# EasyEDA Pro project 试验板v1.eprj

# Schematic Schematic1
Create Date: 2023-01-30; Page Name: P1; Project Name: VerificationBoard; Schematic Name: Schematic1; Update Date: 2023-02-02
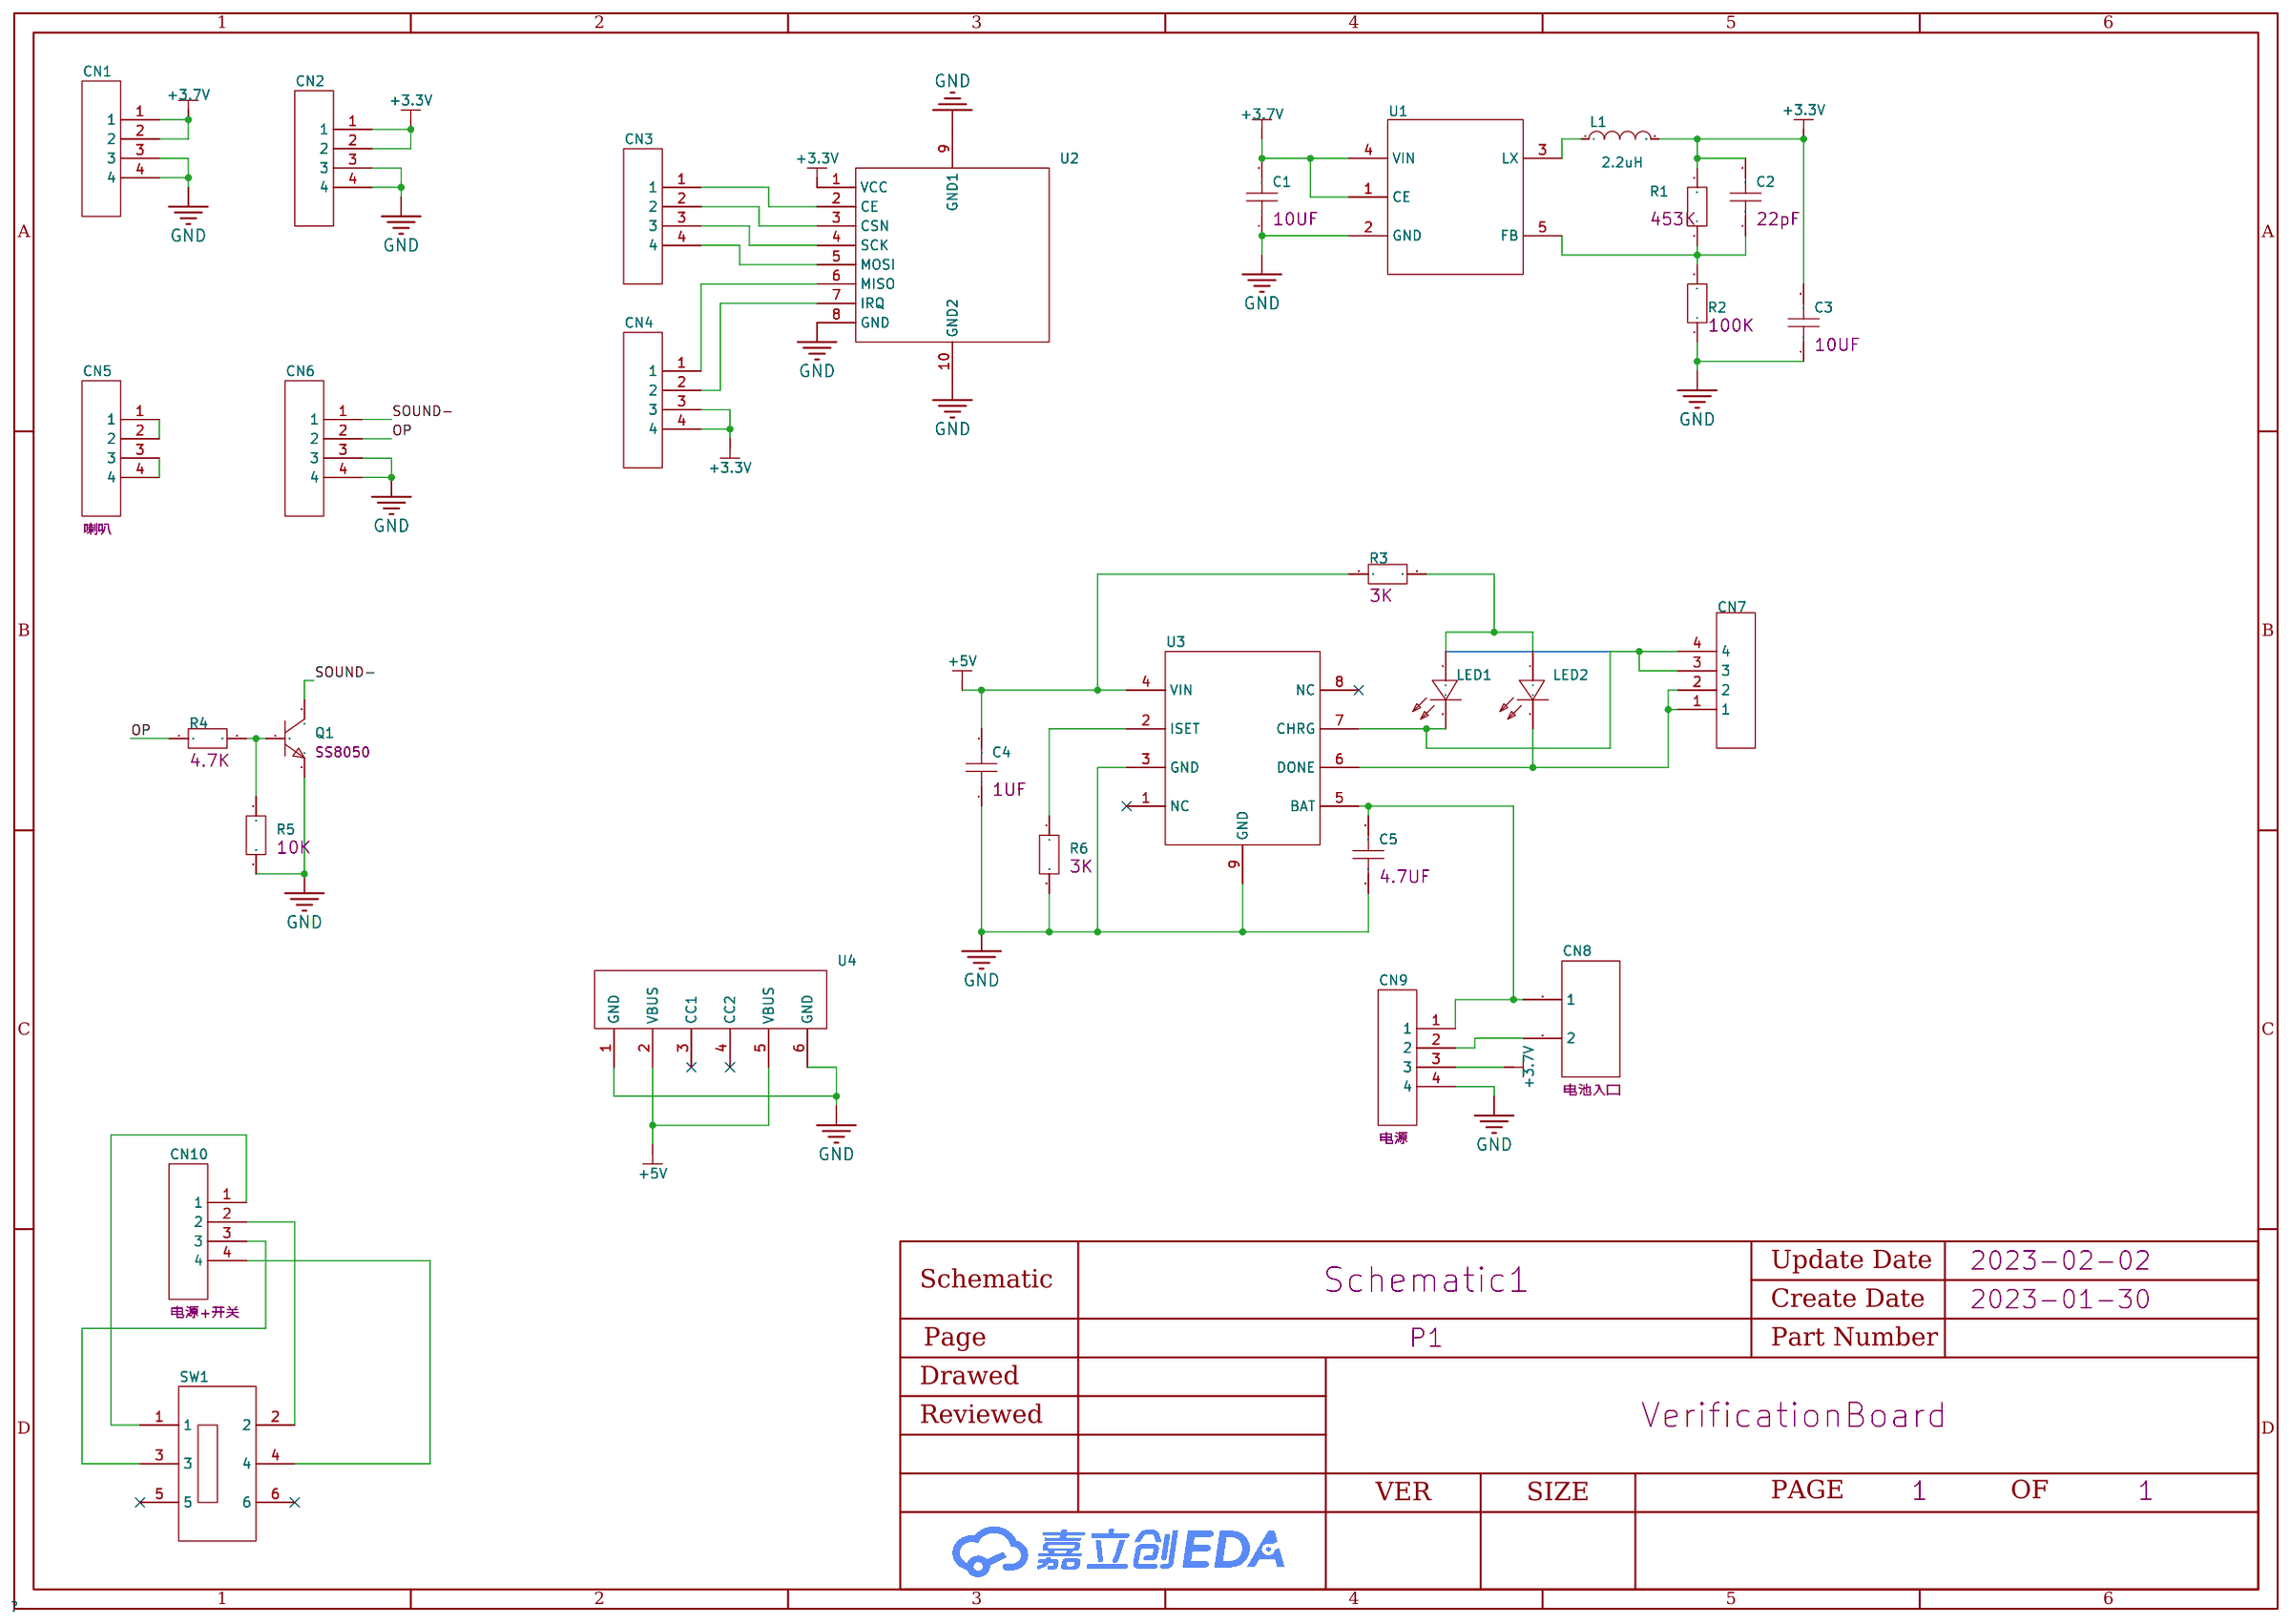
[diagram p0: schematic sheet]

## Parts
C1  -  [0603]
C2  -  [0603]
C3  -  [0603]
C4  -  [0603]
C5  -  [0603]
CN1  -  [2.54-4P插孔洞]  (no BOM)
CN2  -  [2.54-4P插孔洞]  (no BOM)
CN3  -  [2.54-4P插孔洞]  (no BOM)
CN4  -  [2.54-4P插孔洞]  (no BOM)
CN5  -  [2.54-4P插孔洞]  (no BOM)
CN6  -  [2.54-4P插孔洞]  (no BOM)
CN7  -  [2.54-4P插孔洞]  (no BOM)
CN8  -  [XH2.54插件2P]
CN9  -  [2.54-4P插孔洞]  (no BOM)
CN10  -  [2.54-4P插孔洞]  (no BOM)
L1  2.2uH  [IND-SMD_L4.0-W4.0_0.47UH04209.5A]
LED1  NCD0603R3  [LED0603-R-RD_RED]
LED2  NCD0603R3  [LED0603-R-RD_RED]
Q1  SS8050  [SOT-23-3_L2.9-W1.3-P1.90-LS2.4-BR]
R1  -  [0603]
R2  -  [0603]
R3  -  [0603]
R4  -  [0603]
R5  -  [0603]
R6  -  [0603]
SW1  -  [MST-22开关]
U1  -  [PW2051]
U2  -  [GT-24]
U3  -  [PW4056]
U4  -  [typec]

## Library data of the parts
C1 C3 = 电容: 0603 标准贴片电容; Capacitance: 10UF
C2 = 电容: 0603 标准贴片电容; Capacitance: 22pF
C4 = 电容: 0603 标准贴片电容; Capacitance: 1UF
C5 = 电容: 0603 标准贴片电容; Capacitance: 4.7UF
CN1-CN4 CN6 CN7 = 2.54-4P插孔
CN5 = 2.54-4P插孔: 喇叭
CN8 = XH2.54插件2P: 电池入口
CN9 = 2.54-4P插孔: 电源
CN10 = 2.54-4P插孔: 电源+开关
L1 = 2.2uh3a电感: 电感值:2.2uH;精度:±20%;额定电流:3A;直流电阻(DCR):-;; Rated Current: 3A; Supplier: LCSC; Supplier Part: C438930; Supplier Footprint: SMD; JLCPCB Part Class: Extended Part; LCSC Part Name: 2.2uH ±20% 3A; Tolerance: ±20%; Manufacturer: Cybermax(思博科技); Manufacturer Part: CMLO0420H2R2MTT
LED1 LED2 = NCD0603R3: 尺寸1.6x0.8x0.8；IF=20ma：1.6~2.6v，620~640nm,51~150mcd金线，光强高，功耗低，可靠性好，寿命长; LCSC Part Name: 红色;贴片LED;0603红灯;; Supplier Part: C3151730; Manufacturer: 国星光电; Supplier Footprint: 0603; JLCPCB Part Class: Extended Part; Datasheet: https://atta.szlcsc.com/upload/public/pdf/source/20220704/CBFF28C1847A97213A75929E60B7DDE7.pdf; Supplier: LCSC
Q1 = S8050_C5249674: LCSC Part Name: S8050; Supplier Part: C5249674; Manufacturer: ElecSuper(静芯微）; Supplier Footprint: SOT-23; JLCPCB Part Class: Extended Part; Datasheet: https://atta.szlcsc.com/upload/public/pdf/source/20221109/F3F5EDE41344C501BF02B6CC0D78E6D8.pdf; Supplier: LCSC
R1 = 电阻: 0603 标准贴片电阻; Resistance: 453K
R2 = 电阻: 0603 标准贴片电阻; Resistance: 100K
R3 R6 = 电阻: 0603 标准贴片电阻; Resistance: 3K
R4 = 电阻: 0603 标准贴片电阻; Resistance: 4.7K
R5 = 电阻: 0603 标准贴片电阻; Resistance: 10K
SW1 = MST-22开关: 拨动开关A
U1 = PW2051: 3.7V转3.3V降压芯片
U2 = GT-24
U3 = PW4056: 带OVP充电芯片
U4 = typec

## Nets
+3.3V: C2.2 C3.2 CN2.1 CN2.2 CN4.3 CN4.4 L1.2 R1.2 U2.1(VCC)
+3.7V: C1.2 CN1.1 CN1.2 CN9.3 U1.1(CE) U1.4(VIN)
+5V: C4.2 R3.2 U3.4(VIN) U4.2(VBUS) U4.5(VBUS)
GND: C1.1 C3.1 C4.1 C5.1 CN1.3 CN1.4 CN2.3 CN2.4 CN6.3 CN6.4 CN9.4 Q1.2(E) R2.1 R5.2 R6.2 U1.2(GND) U2.8(GND) U2.9(GND1) U2.10(GND2) U3.3(GND) U3.9(GND) U4.1(GND) U4.6(GND)
OP: CN6.2 R4.1
SOUND-: CN6.1 Q1.3(C)
$1N458: CN10.4 SW1.4
$1N1165: L1.1 U1.3(LX)
$1N1197: C2.1 R1.1 R2.2 U1.5(FB)
$1N2796: CN3.1 U2.2(CE)
$1N2813: CN3.2 U2.3(CSN)
$1N2830: CN3.3 U2.4(SCK)
$1N2847: CN3.4 U2.5(MOSI)
$1N2864: CN4.1 U2.6(MISO)
$1N2879: CN4.2 U2.7(IRQ)
$1N3532: Q1.1(B) R4.2 R5.1
$1N4439: CN5.1 CN5.2
$1N4485: CN5.3 CN5.4
$1N5313: CN10.1 SW1.1
$1N5402: CN10.3 SW1.3
$1N5799: C5.2 CN8.1 CN9.1 U3.5(BAT)
$1N5821: CN8.2 CN9.2
$1N6560: CN10.2 SW1.2
$1N7622: CN7.3 CN7.4 LED1.2(K) U3.7(CHRG)
$1N7734: CN7.1 CN7.2 LED2.2(K) U3.6(DONE)
$1N7769: LED1.1(A) LED2.1(A) R3.1
$1N9103: R6.1 U3.2(ISET)

Not connected (* = marked no-connect by the designer): SW1 5* 6*; U3 1(NC)* 8(NC)*; U4 3(CC1)* 4(CC2)*

# Board PCB1
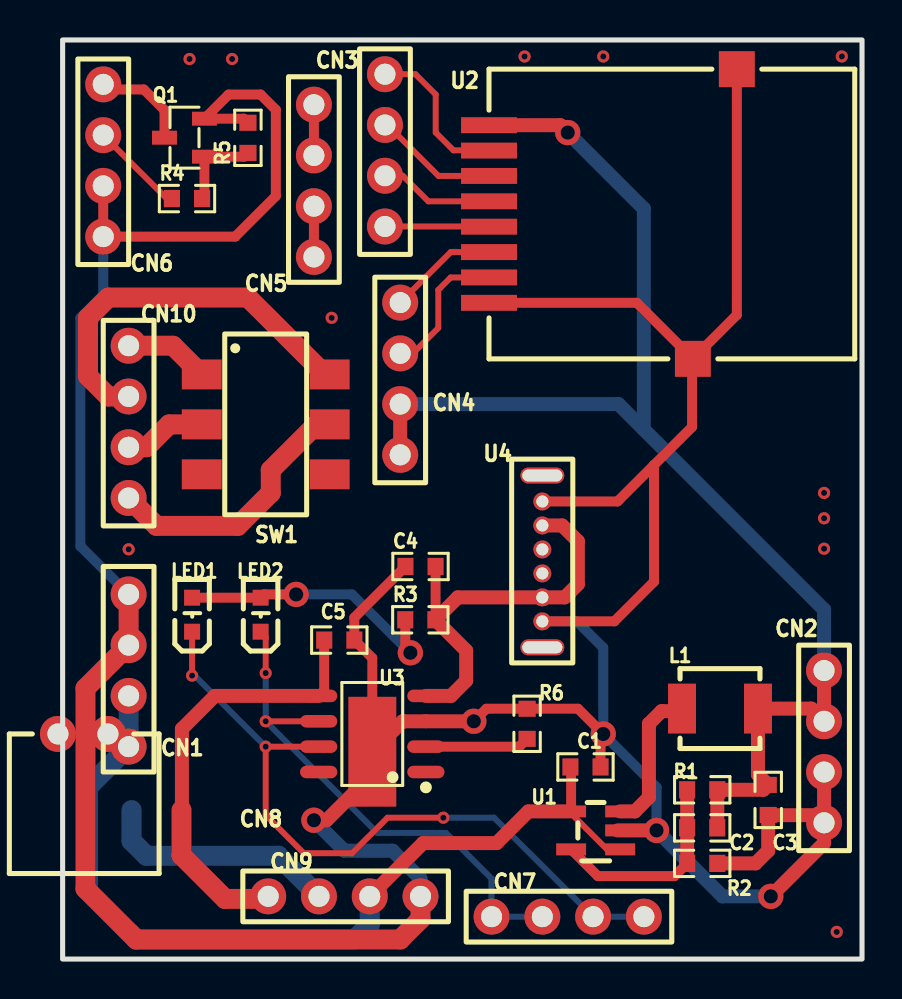
[diagram p1: board, top side]
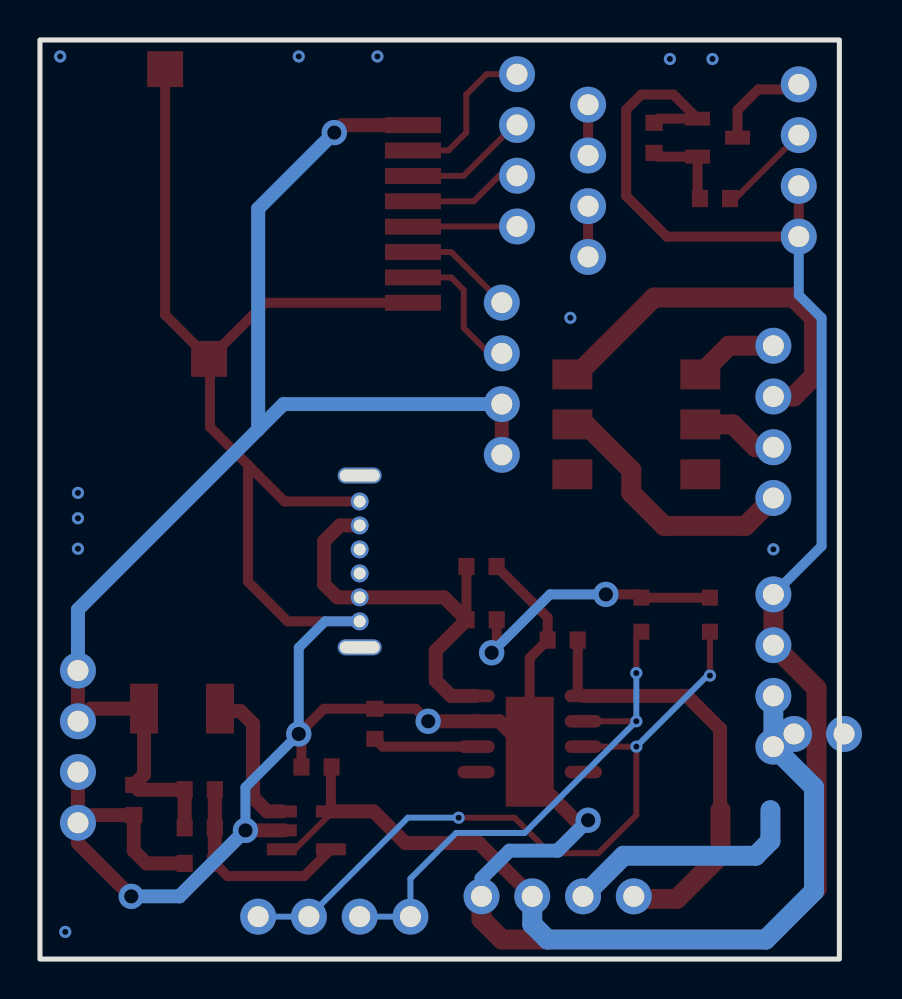
[diagram p2: board, bottom side, seen from below]

Outline 40 x 46 mm; copper layers: Top Layer, Bottom Layer. Coordinates in mm from the lower left corner of the outline.
Outline path: rectangle 0,46 40,0
Stack: Top Layer 0.035mm / Dielectric1 1.51mm FR4 er 4.5 / Bottom Layer 0.035mm

## Design rules (mm)
spacing safeClearance (default): track to track 0.152, other pairs 0.152 to 0.3
track width trackWidth (default): min 0.127, default 0.254, max 2.54
differential pair differentialPair (default): width min 0.127, default 0.254, max 2.54; gap min 0.152, default 0.152
via viaSize (default): diameter min 0.5, default 0.61, max 10; hole min 0.3, default 0.305, max 6

## Placement (name value [footprint] x y rotation side)
C1  -  [0603]  26.16 9.61 180 top
C2  -  [0603]  32 6.57 0 top
C3  -  [0603]  35.31 7.96 90 top
C4  -  [0603]  17.91 19.65 0 top
C5  -  [0603]  13.84 15.96 180 top
CN1  -  [2.54-4P插孔洞]  3.3 10.63 90 top
CN2  -  [2.54-4P插孔洞]  38.1 14.44 270 top
CN3  -  [2.54-4P插孔洞]  16.13 44.28 270 top
CN4  -  [2.54-4P插孔洞]  16.89 32.85 270 top
CN5  -  [2.54-4P插孔洞]  12.57 35.14 90 top
CN6  -  [2.54-4P插孔洞]  2.03 43.78 270 top
CN7  -  [2.54-4P插孔洞]  21.46 2.12 0 top
CN8  -  [XH2.54插件2P]  1.02 7.45 0 top
CN9  -  [2.54-4P插孔洞]  10.29 3.14 0 top
CN10  -  [2.54-4P插孔洞]  3.3 30.7 270 top
L1  2.2uH  [IND-SMD_L4.0-W4.0_0.47UH04209.5A]  32.89 12.53 0 top
LED1  NCD0603R3  [LED0603-R-RD_RED]  6.48 17.23 90 top
LED2  NCD0603R3  [LED0603-R-RD_RED]  9.91 17.23 90 top
Q1  SS8050  [SOT-23-3_L2.9-W1.3-P1.90-LS2.4-BR]  6.1 41.11 0 top
R1  -  [0603]  32 8.47 0 top
R2  -  [0603]  32 4.79 180 top
R3  -  [0603]  17.9 16.98 0 top
R4  -  [0603]  6.22 38.06 0 top
R5  -  [0603]  9.27 41.1 90 top
R6  -  [0603]  23.24 11.77 90 top
SW1  -  [MST-22开关]  10.16 26.76 0 top
U1  -  [PW2051]  26.67 6.44 0 top
U2  -  [GT-24]  21.34 44.54 0 top
U3  -  [PW4056]  15.49 11.26 90 top
U4  -  [typec]  24 19.9 90 top

## Footprints (pads in the part's own frame, mm; a bottom-side part is the same pattern mirrored in y, then rotated)
2.54-4P插孔洞
  round 1.8 hole 1.05: 1(0,0) 2(2.54,0) 3(5.08,0) 4(7.62,0)
0603
  rect 0.806x0.864 smd: 1(-0.753,0) 2(0.753,0)
GT-24
  rect 2.8x0.8 smd: 1(0,-2.805) 2(0,-4.075) 3(0,-5.345) 4(0,-6.615) 5(0,-7.885) 6(0,-9.155) 7(0,-10.425) 8(0,-11.695)
  rect 1.8x1.8 smd: 9(12.4,0) 10(10.2,-14.5)
IND-SMD_L4.0-W4.0_0.47UH04209.5A
  rect 1.399x2.499 smd: 1(-1.9,0) 2(1.9,0)
LED0603-R-RD_RED
  rect 0.8x0.8 smd: 1(0.851,0) 2(-0.851,0)
MST-22开关
  rect 2x1.5 smd: 1(-3.2,2.5) 2(3.2,2.5) 3(-3.2,0) 4(3.2,0) 5(-3.2,-2.5) 6(3.2,-2.5)
PW2051
  rect 1.5x0.6 smd: 1(1.227,-0.95) 2(1.227,0) 3(1.227,0.95) 4(-1.227,0.95) 5(-1.227,-0.95)
PW4056
  oval 0.63x1.865 smd: 1(-1.905,-2.683) 2(-0.635,-2.683) 3(0.635,-2.683) 4(1.905,-2.683) 5(1.905,2.683) 6(0.635,2.683) 7(-0.635,2.683) 8(-1.905,2.683)
  rect 5.5x2.4 smd: 9(-0.889,0)
SOT-23-3_L2.9-W1.3-P1.90-LS2.4-BR
  rect 1.25x0.7 smd: 1(1,-0.95) 2(1,0.95) 3(-1,0)
typec
  round 0.9 hole 0.6: 1(-3,0) 2(-1.8,0) 3(-0.6,0) 4(0.6,0) 5(1.8,0) 6(3,0)
  oval 0.8x2.2 hole 0.6x2: 7(-4.3,0) 8(4.3,0)
XH2.54插件2P
  round 1.8 hole 1.05: 1(1.25,3.81) 2(-1.25,3.81)

## Nets
As in the schematic.

Pads without a net: SW1 5 6; U3 1 8; U4 3 4 7 8

## Via types
v1: diameter 0.61, hole 0.305, Top Layer to Bottom Layer, 16 vias
v2: diameter 1.27, hole 0.711, Top Layer to Bottom Layer, 8 vias

## Routing (per net, layer and track width the routed paths; a pad name or vN(x,y) marks a point on that pad's centre or on a via; arc(x,y) is an arc through that point)
+3.3V: length 66.3
  Top Layer w0.7: CN2.1 CN2.2 37.47,12.53 L1.2 34.79,9.23 C3.2 35.06,8.47 R1.2 C2.2 ; v2(25.27,41.36) 24.9,41.73 21.34,41.73 ; CN4.3 CN4.4
  Bottom Layer w0.7: CN4.3 27.81,27.77 29.08,26.51 ; v2(25.27,41.36) 29.08,37.56 29.08,26.51 ; CN2.1 38.1,17.49 29.08,26.51
+3.7V: length 44.8
  Top Layer w0.3: U1.4 25.44,7.28 27.24,5.49 U1.1
  Top Layer w0.5: U1.4 25.44,9.58 C1.2
  Top Layer w0.7: CN9.3 18.03,5.8 21.72,5.8 23.3,7.39 U1.4
  Bottom Layer w1: CN1.2 CN1.1 1.27,8.6 1.27,3.39 3.68,0.98 14.6,0.98 15.37,1.74 CN9.3
+5V: length 20.8
  Top Layer w0.5: C4.2 18.66,16.99
  Top Layer w0.7: 18.66,16.99 19.77,18.1 U4.2 25.12,18.1 25.78,18.76 25.78,20.92 25,21.7 U4.5 ; 18.65,16.98 20.19,15.44 20.19,13.93 19.43,13.17 U3.4
GND: length 204.4
  Top Layer w0.5: 31.54,30.04 31.5,30 31.5,26.63 29.59,24.72 ; 31.54,30.04 33.74,32.24 U2.9 ; 31.54,30.04 28.73,32.84 U2.8 ; CN6.3 CN6.4 8.64,36.16 10.67,38.19 10.67,42.51 9.91,43.27 8.31,43.27 Q1.2 9.07,42.06 R5.2 ; U4.1 27.61,16.9 29.59,18.88 29.59,24.72 29.59,24.72 ; U3.9 15.49,15.07 C5.1 14.6,17.09 C4.1 ; C1.1 26.92,11.13 v2(27.05,11.26) 25.79,12.53 R6.2 21.2,12.53 v2(20.57,11.9) ; 29.59,24.72 27.76,22.9 U4.6
  Top Layer w0.7: CN2.4 38.1,5.8 v2(35.43,3.14) ; CN2.4 37.72,7.2 35.31,7.2 C3.1 35.31,5.42 34.67,4.79 R2.1 ; CN2.4 CN2.3 ; v2(12.57,6.95) 13.21,6.95 15.49,9.23 U3.9 17.02,11.9 U3.3 v2(20.57,11.9) ; v2(29.72,6.44) 27.77,6.44
  Top Layer w1: CN9.4 17.91,1.99 16.89,0.98 3.68,0.98 1.14,3.52 1.14,13.55 CN1.3 CN1.4
  Bottom Layer w0.5: U4.1 25.73,16.9 27.05,15.58 v2(27.05,11.26) 29.72,8.6 v2(29.72,6.44) ; CN6.4 2.03,33.24 0.89,32.09 0.89,20.66 CN1.4
  Bottom Layer w0.7: v2(12.57,6.95) 14.1,5.42 16.51,5.42 17.91,4.03 CN9.4 ; v2(35.43,3.14) 33.02,3.14 v2(29.72,6.44)
  vias: v1(3.3,20.51) v1(6.35,45.05) v1(8.48,45.05) v1(13.46,32.09) v1(23.11,45.17) v1(27.05,45.17) v1(38.1,23.33) v1(38.1,22.06) v1(38.1,20.54) v1(38.73,1.36) v1(38.99,45.17)
OP: length 4.8
  Top Layer w0.3: R4.1 5.21,38.06 CN6.2
SOUND-: length 5
  Top Layer w0.5: Q1.3 5.1,42.49 4.06,43.52 2.29,43.52 CN6.1
$1N458: length 13.4
  Top Layer w1: CN10.4 4.7,21.68 8.76,21.68 10.41,23.33 10.41,24.47 12.7,26.76 SW1.4
$1N1165: length 7.4
  Top Layer w0.7: L1.1 30.87,12.41 29.97,12.41 29.34,11.77 29.34,8.09 28.64,7.39 U1.3
$1N1197: length 10.3
  Top Layer w0.5: U1.5 26.78,4.15 30.62,4.15 R2.2
  Top Layer w0.7: R2.2 C2.1 R1.1
$1N2796: length 7.1
  Top Layer w0.3: 16.89,44.28 17.65,44.28 18.67,43.27 18.67,41.36 19.56,40.47 21.32,40.47 U2.2
$1N2813: length 6.1
  Top Layer w0.3: U2.3 18.81,39.19 16.26,41.74
$1N2830: length 5
  Top Layer w0.3: 16.89,39.2 17.02,39.2 18.3,37.92 U2.4
$1N2847: length 4.4
  Top Layer w0.3: 16.89,36.66 21.32,36.66 21.34,36.65
$1N2864: length 5.5
  Top Layer w0.3: CN4.1 19.42,35.38 U2.6
$1N2879: length 7.1
  Top Layer w0.3: U2.7 19.42,34.11 18.8,33.49 18.8,31.58 17.53,30.31 CN4.2
$1N3532: length 4.4
  Top Layer w0.5: R5.1 9.08,40.16 Q1.1 7.1,38.18 R4.2
$1N4439: length 2.5
  Top Layer w0.5: CN5.2 CN5.1
$1N4485: length 2.5
  Top Layer w0.5: CN5.4 CN5.3
$1N5313: length 4.3
  Top Layer w1: SW1.1 5.52,30.7 CN10.1
$1N5402: length 4.1
  Top Layer w1: CN10.3 4.19,25.62 5.33,26.76 SW1.3
$1N5799: length 22.1
  Top Layer w0.5: C5.2 13.09,13.45 U3.5
  Top Layer w0.7: U3.5 7.62,13.17 5.97,11.52 5.97,7.47 5.95,7.45
  Top Layer w1: CN9.1 10.16,3.01 8.13,3.01 5.95,5.19 5.95,7.45
$1N5821: length 12.1
  Bottom Layer w1: CN9.2 10.79,5.17 4.19,5.17 3.45,5.91 3.45,7.45
$1N6560: length 19.5
  Top Layer w1: CN10.2 2.29,28.16 1.27,29.17 1.27,32.09 2.29,33.11 9.27,33.11 13.12,29.26 SW1.2
$1N7622: length 35.9
  Top Layer w0.3: v1(19.05,7.07) 16.26,7.07 14.48,5.3 12.06,5.3 10.16,7.2 v1(10.16,10.63) 12.81,10.63 ; v1(6.48,14.19) LED1.2
  Bottom Layer w0.3: v1(6.48,14.19) 6.6,14.19 v1(10.16,10.63) ; v1(19.05,7.07) 21.59,7.07 CN7.3 CN7.4
$1N7734: length 26.2
  Top Layer w0.3: v1(10.16,14.31) 10.16,16.13 LED2.2 ; U3.6 v1(10.16,11.9)
  Bottom Layer w0.3: v1(10.16,14.31) v1(10.16,11.9) 15.75,6.31 19.18,6.31 21.46,4.03 CN7.1 CN7.2
$1N7769: length 14
  Top Layer w0.5: R3.1 17.15,15.58 v2(17.4,15.33) ; LED1.1 LED2.1 10.07,18.25 v2(11.68,18.25)
  Bottom Layer w0.5: v2(11.68,18.25) 14.48,18.25 v2(17.4,15.33)
$1N9103: length 5.2
  Top Layer w0.5: R6.1 22.85,10.63 18.18,10.63
